# Altium schematic sheet S2C_SelectJTAG.SchDoc
size A4; SheetNumber: 16
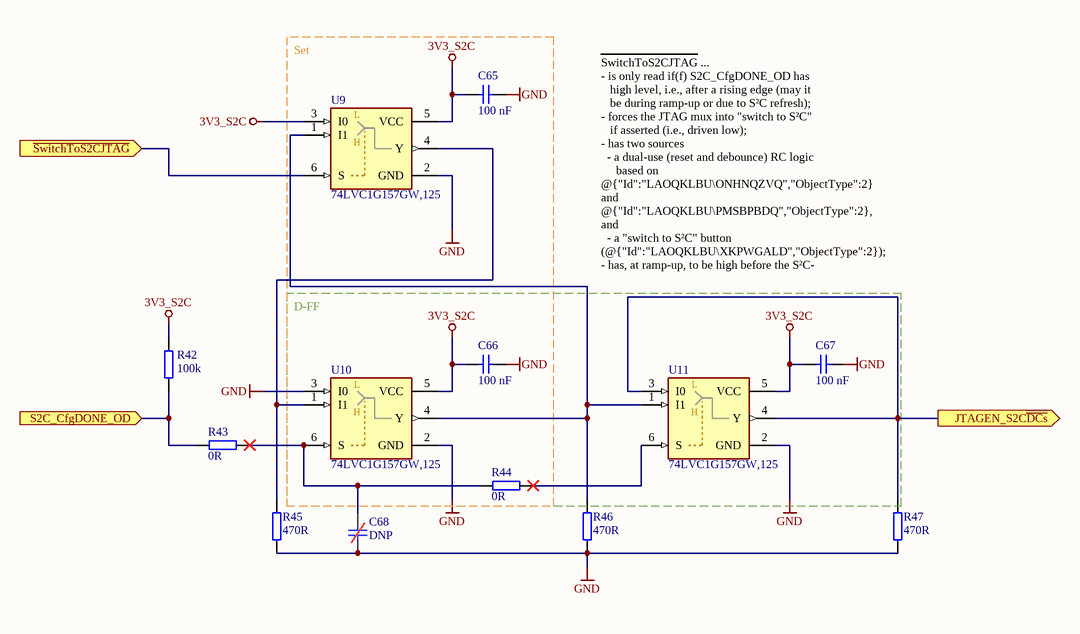
[diagram p0: S2C_SelectJTAG.SchDoc]

## Parts
C65  100 nF  [C_0603_TE]
C66  100 nF  [C_0603_TE]
C67  100 nF  [C_0603_TE]
C68  DNP  [C_0603_TE-DNP]  (no BOM)
R42  100k  [R_0603_TE]
R43  0R  [R_0603_TE]
R44  0R  [R_0603_TE]
R45  470R  [R_0603_TE]
R46  470R  [R_0603_TE]
R47  470R  [R_0603_TE]
U9  74LVC1G157GW,125  [SOT-363]
U10  74LVC1G157GW,125  [SOT-363]
U11  74LVC1G157GW,125  [SOT-363]

## Blocks framed on the sheet
D-FF: C66 C67 R44 U10 U11

## Ports
JTAGEN_S2C~{DCs} (out), S2C_CfgDONE_OD (in), ~{SwitchToS2CJTAG} (in)

## Nets
3V3_S2C: C65.2 C66.2 C67.2 R42.2 U9.3(I0) U9.5(VCC) U10.5(VCC) U11.5(VCC)
GND: C65.1 C66.1 C67.1 C68.1 R45.1 R46.1 R47.1 U9.2(GND) U10.2(GND) U10.3(I0) U11.2(GND)
JTAGEN_S2C~{DCs}: R47.2 U11.3(I0) U11.4(Y) ; port JTAGEN_S2C~{DCs}
S2C_CfgDONE_OD: R42.1 R43.2 ; port S2C_CfgDONE_OD
~{SwitchToS2CJTAG}: U9.6(S) ; port ~{SwitchToS2CJTAG}
NetC68_2: C68.2 R43.1 R44.2 U10.6(S)
NetR44_1: R44.1 U11.6(S)
NetR45_2: R45.2 U9.4(Y) U10.1(I1)
NetR46_2: R46.2 U9.1(I1) U10.4(Y) U11.1(I1)

## Notes on the sheet
- Set
- SwitchToS2CJTAG ...
  - is only read if(f) S2C_CfgDONE_OD has
  high level, i.e., after a rising edge (may it
  be during ramp-up or due to S²C refresh);
  - forces the JTAG mux into "switch to S²C"
  if asserted (i.e., driven low);
  - has two sources
  - a dual-use (reset and debounce) RC logic
  based on @{"Id":"LAOQKLBU\ONHNQZVQ","ObjectType":2} and @{"Id":"LAOQKLBU\PMSBPBDQ","ObjectType":2}, and
  - a "switch to S²C" button (@{"Id":"LAOQKLBU\XKPWGALD","ObjectType":2});
  - has, at ramp-up, to be high before the S²C-
  based rising edge on S2C_CfgDONE_OD
  for the switch-over (to the five D CPLDs)
  to be successful; and
  - thus needs an RC time constant in the sub-
  ms range (as config time is going to vary).
- Title
- Revision:
- Design Engineer:
- Date:
- Project:
- Sheet
- of
- (in symbol 74LVC1G157GW,125) L; H

## Library data of the parts
C65-C67 = UZgen_C_0603_100nF_50V_X7R: Generic capacitor; Manufacturer: UZgen; Voltage: 50V; Tolerance: 10 %; Created from: AGeiger; Manufacturer Part Number: UZgen_C_0603_100nF_50V_X7R; PartID: 1; Created On: 02/07/2024 14:42:23; Value: 100 nF; Device Package: 0603; Technology: X7R; Mounting Type: SMD; Last Updated: 08/08/2024 15:01:15
C68 = UZgen_C_0603_DNP: Generic capacitor (DNP); Manufacturer: UZgen; Created from: UZgenTool; Manufacturer Part Number: UZgen_C_0603_DNP; PartID: 5812; Created On: 29/03/2025 17:15:00; Value: DNP; Device Package: 0603; Voltage: -; Technology: -; Tolerance: -; Mounting Type: SMD; Last Updated: 02/04/2025 19:05:00
R42 = UZgen_R_0603_100k: Generic resistor; Manufacturer: UZgen; Tolerance: 1 %; Created from: UZgenTool; Manufacturer Part Number: UZgen_R_0603_100k; PartID: 268; Created On: 02/07/2024 17:29:50; Value: 100k; Device Package: 0603; Mounting Type: SMD; Last Updated: 02/07/2024 17:29:50
R43 R44 = UZgen_R_0603_0R: Generic resistor; Manufacturer: UZgen; Tolerance: 1 %; Created from: UZgenTool; Manufacturer Part Number: UZgen_R_0603_0R; PartID: 581; Created On: 08/07/2024 14:34:30; Value: 0R; Device Package: 0603; Mounting Type: SMD; Last Updated: 08/07/2024 14:34:30
R45-R47 = UZgen_R_0603_470R: Generic resistor; Manufacturer: UZgen; Tolerance: 1 %; Created from: UZgenTool; Manufacturer Part Number: UZgen_R_0603_470R; PartID: 213; Created On: 02/07/2024 17:29:49; Value: 470R; Device Package: 0603; Mounting Type: SMD; Last Updated: 02/07/2024 17:29:49
U9-U11 = 74LVC1G157GW,125: Single 2-input multiplexer; Manufacturer: Nexperia; Created from: MGeier; Manufacturer Part Number: 74LVC1G157GW,125; PartID: 21; Created On: 11/03/2025 22:40:00; ComponentLink1Description: Datasheet; ComponentLink1URL: https://assets.nexperia.com/documents/data-sheet/74LVC1G157.pdf; Component Type: Multiplexer; Device Package: TSSOP-6; Last Updated: 11/03/2025 22:40:00; Mounting Type: SMD; Operating Temperature: -40 - +125 °C; Supplier 1: LCSC; Supplier Part Number 1: C135822; Type: Multiplexer; Live Cycle Status: 1; LCSC Part Number: C135822